# EAGLE design Inteligentny czujnik pojemnościowy (EAGLE 8.0.1)

## Sheet 1 of 2
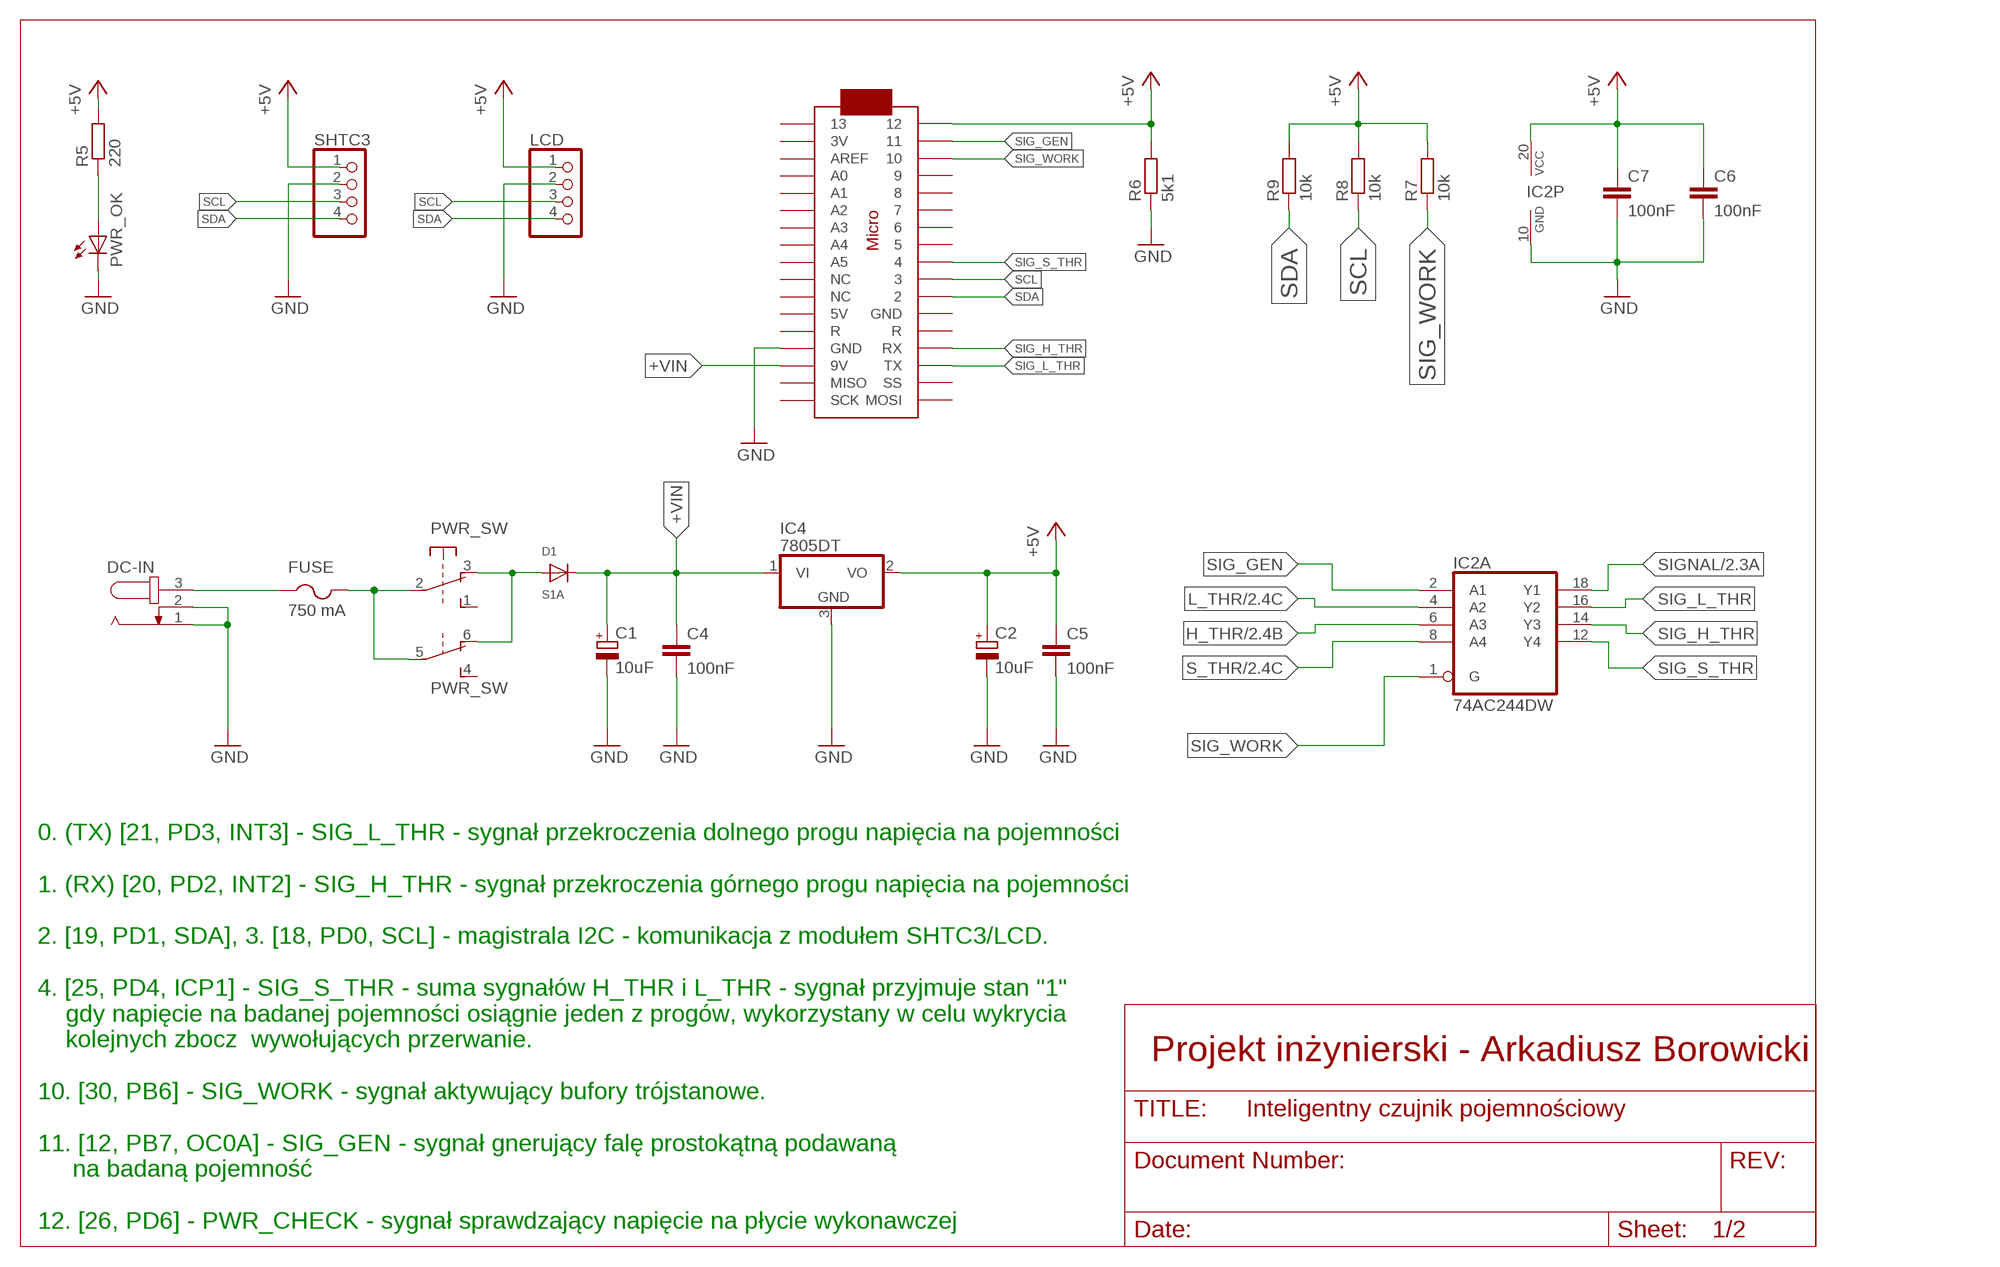
[diagram p0: schematic, sheet 1]

### Parts
C1  10uF  CPOL-EU153CLV-0605  [153CLV-0605]
C2  10uF  CPOL-EU153CLV-0605  [153CLV-0605]
C4  100nF  C-EUC1206K  [C1206K]
C5  100nF  C-EUC1206K  [C1206K]
C6  100nF  C-EUC1206K  [C1206K]
C7  100nF  C-EUC1206K  [C1206K]
D1  S1A  DIODESMA  [SMADIODE]
DC-IN  JACK-PLUG1  [SPC4078]
FUSE  750 mA  PTCFUSE-1812  [1812]
IC2  74AC244DW  [SO20W]
IC4  7805DT  [TO252]
LCD  PINHD-1X4  [1X04]
PWR_OK  LEDSMT1206  [1206]
PWR_SW  9077-2  [9077-2]
R5  220  R-EU_R1206  [R1206]
R6  5k1  R-EU_R1206  [R1206]
R7  10k  R-EU_R1206  [R1206]
R8  10k  R-EU_R1206  [R1206]
R9  10k  R-EU_R1206  [R1206]
SHTC3  PINHD-1X4  [1X04]
U$1  ARDUINOMICRO  [ARDUINOMICRO]

### Nets
+5V: C2.+ C5.1 C6.1 C7.1 IC2.20(P:VCC) IC4.2(VO) LCD.1 R5.2 R6.2 R7.2 R8.2 R9.2 SHTC3.1 U$1.P$1 ; also sheet 2
+VIN: C1.+ C4.1 D1.C IC4.1(VI) U$1.P$20(9V)
GND: C1.- C2.- C4.2 C5.2 C6.2 C7.2 DC-IN.1 DC-IN.2 IC2.10(P:GND) IC4.3(GND) LCD.2 PWR_OK.C R6.1 SHTC3.2 U$1.P$12(GND) ; also sheet 2
H_THR: IC2.6(A:A3) ; also sheet 2
L_THR: IC2.4(A:A2) ; also sheet 2
N$4: DC-IN.3 FUSE.1
N$5: PWR_OK.A R5.1
N$6: D1.A PWR_SW.3(1:O) PWR_SW.6(2:O)
N$8: FUSE.2 PWR_SW.2(1:P) PWR_SW.5(2:P)
S_THR: IC2.8(A:A4) ; also sheet 2
SCL: LCD.3 R8.1 SHTC3.3 U$1.P$10
SDA: LCD.4 R9.1 SHTC3.4 U$1.P$11
SIG_GEN: IC2.2(A:A1) U$1.P$2
SIG_H_THR: IC2.14(A:Y3) U$1.P$14(RX)
SIG_L_THR: IC2.16(A:Y2) U$1.P$15(TX)
SIG_S_THR: IC2.12(A:Y4) U$1.P$9
SIG_WORK: IC2.1(A:G) R7.1 U$1.P$3
SIGNAL: IC2.18(A:Y1) ; also sheet 2
Unconnected: IC2.3(B:Y4) IC2.5(B:Y3) IC2.7(B:Y2) IC2.9(B:Y1) IC2.11(B:A1) IC2.13(B:A2) IC2.15(B:A3) IC2.17(B:A4) IC2.19(B:G) PWR_SW.1(1:S) PWR_SW.4(2:S) U$1.P$4 U$1.P$5 U$1.P$6 U$1.P$7 U$1.P$8 U$1.P$13(R) U$1.P$16(SS) U$1.P$17(MOSI) U$1.P$18(SCK) U$1.P$19(MISO) U$1.P$21(GND) U$1.P$22(R) U$1.P$23(5V) U$1.P$24(NC) U$1.P$25(NC) U$1.P$26(A5) U$1.P$27(A4) U$1.P$28(A3) U$1.P$29(A2) U$1.P$30(A1) U$1.P$31(A0) U$1.P$32(AREF) U$1.P$33(3V) U$1.P$34

### Notes on the sheet
- Projekt inżynierski - Arkadiusz Borowicki
- 0. (TX) [21, PD3, INT3] - SIG_L_THR - sygnał przekroczenia dolnego progu napięcia na pojemności 
      
  1. (RX) [20, PD2, INT2] - SIG_H_THR - sygnał przekroczenia górnego progu napięcia na pojemności
  
  2. [19, PD1, SDA], 3. [18, PD0, SCL] - magistrala I2C - komunikacja z modułem SHTC3/LCD.
  
  4. [25, PD4, ICP1] - SIG_S_THR - suma sygnałów H_THR i L_THR - sygnał przyjmuje stan "1"
      gdy napięcie na badanej pojemności osiągnie jeden z progów, wykorzystany w celu wykrycia
      kolejnych zbocz  wywołujących przerwanie.
  
  10. [30, PB6] - SIG_WORK - sygnał aktywujący bufory trójstanowe. 
  
  11. [12, PB7, OC0A] - SIG_GEN - sygnał gnerujący falę prostokątną podawaną 
       na badaną pojemność
  
  12. [26, PD6] - PWR_CHECK - sygnał sprawdzający napięcie na płycie wykonawczej

## Sheet 2 of 2
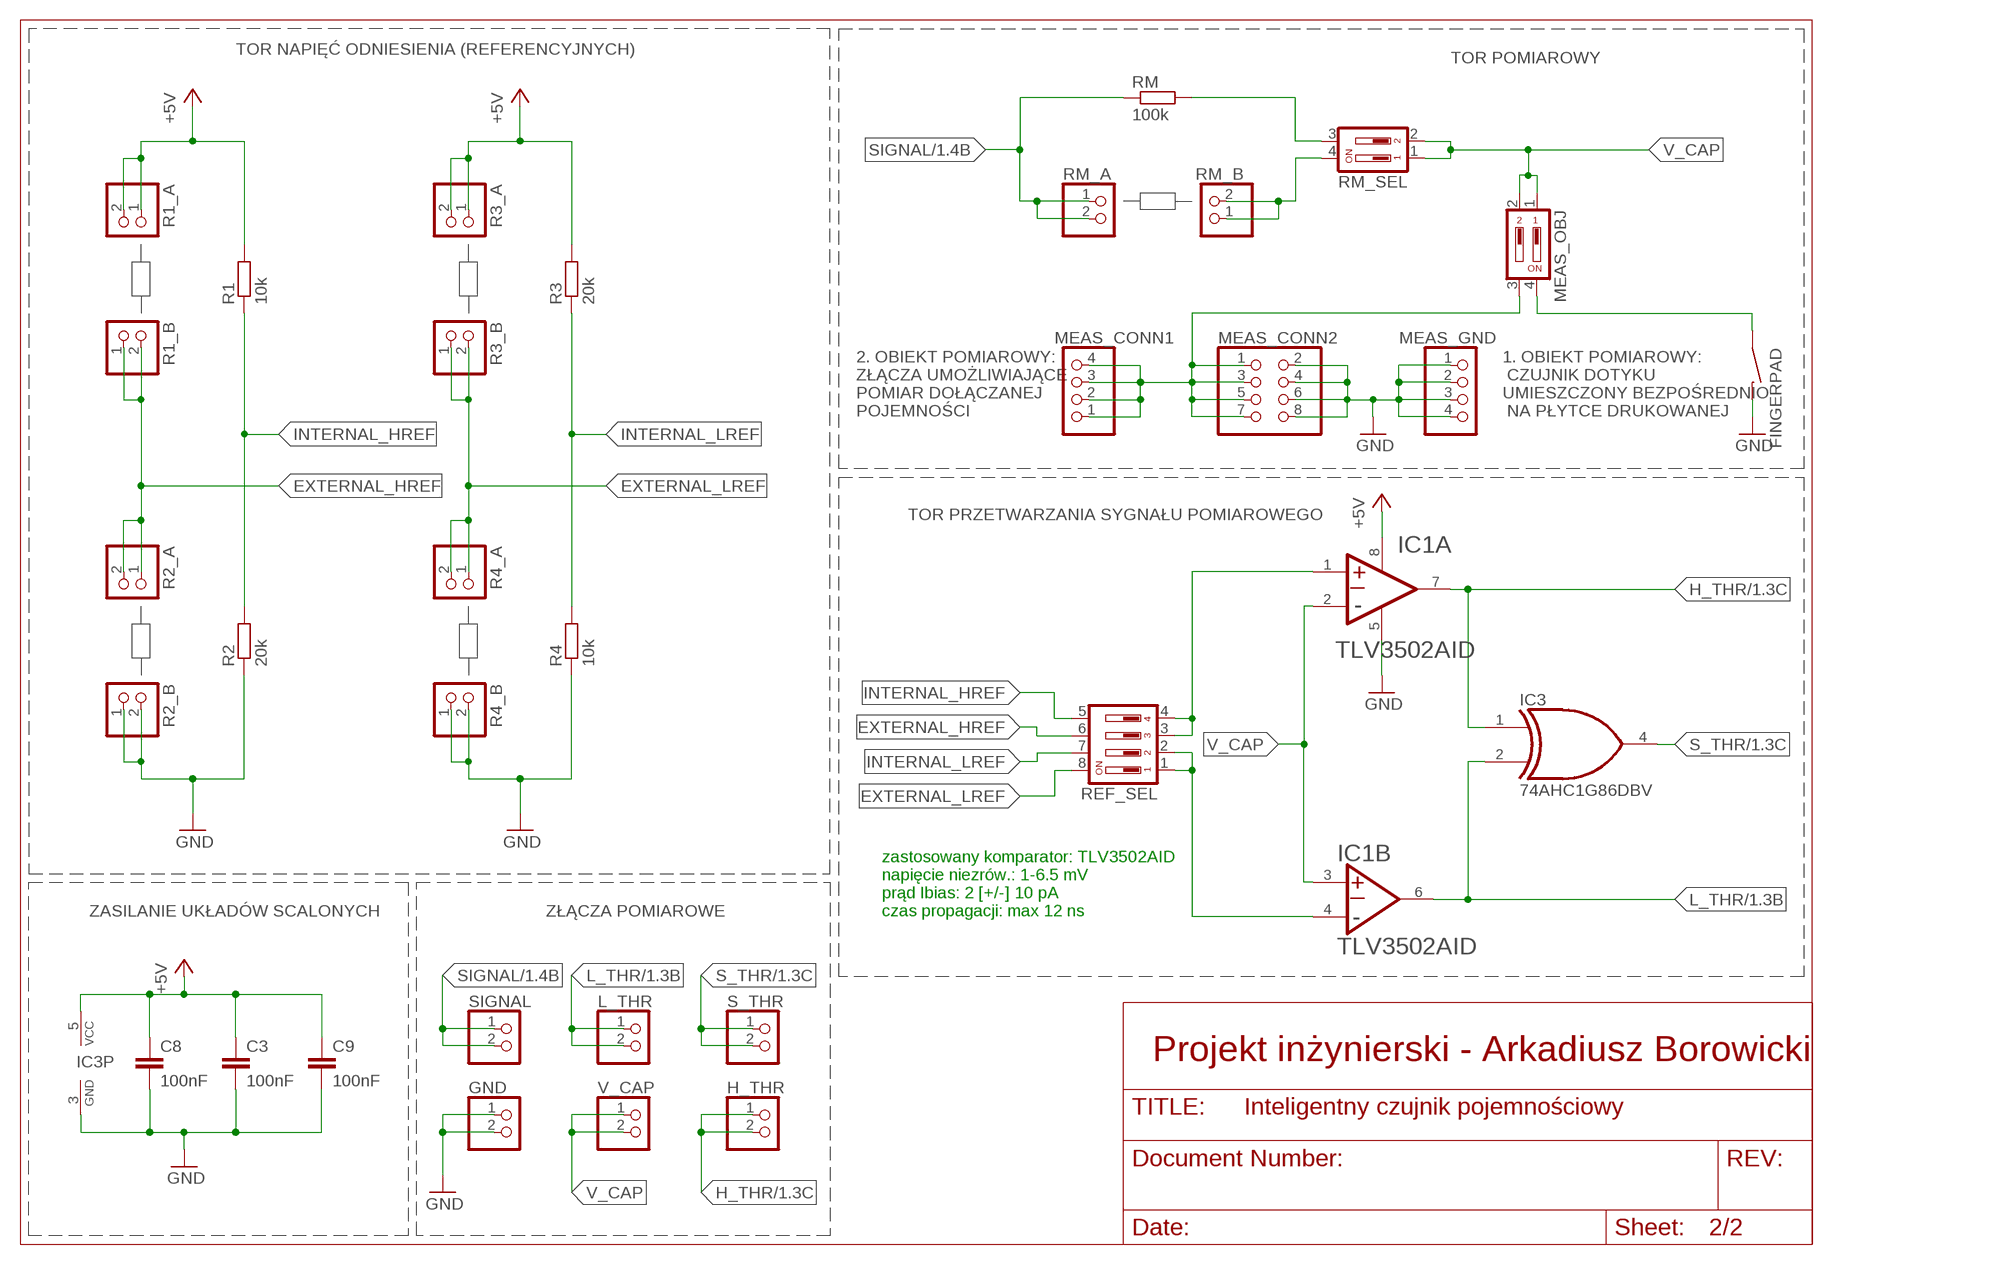
[diagram p1: schematic, sheet 2]

### Parts
C3  100nF  C-EUC1206K  [C1206K]
C8  100nF  C-EUC1206K  [C1206K]
C9  100nF  C-EUC1206K  [C1206K]
FINGERPAD  FINGERPAD-2B  [FINGERPAD-2B]
GND  PINHD-1X2  [1X02]
H_THR  PINHD-1X2  [1X02]
IC1  TEXAS_INSTRUMENTS_TLV3502AIDTEXAS_INSTRUMENTS_TLV3502AID_0_1  [TEXAS_INSTRUMENTS_TLV3502AID_1]
IC3  74AHC1G86DBV  [SOT23-5]
L_THR  PINHD-1X2  [1X02]
MEAS_CONN1  PINHD-1X4  [1X04]
MEAS_CONN2  PINHD-2X4  [2X04]
MEAS_GND  PINHD-1X4  [1X04]
MEAS_OBJ  219-02  [CTS-219-02]
R1  10k  R-EU_M1206  [M1206]
R1_A  PINHD-1X2  [1X02]
R1_B  PINHD-1X2  [1X02]
R2  20k  R-EU_M1206  [M1206]
R2_A  PINHD-1X2  [1X02]
R2_B  PINHD-1X2  [1X02]
R3  20k  R-EU_M1206  [M1206]
R3_A  PINHD-1X2  [1X02]
R3_B  PINHD-1X2  [1X02]
R4  10k  R-EU_M1206  [M1206]
R4_A  PINHD-1X2  [1X02]
R4_B  PINHD-1X2  [1X02]
REF_SEL  219-04  [CTS-219-04]
RM  100k  R-EU_M1206  [M1206]
RM_A  PINHD-1X2  [1X02]
RM_B  PINHD-1X2  [1X02]
RM_SEL  219-02  [CTS-219-02]
S_THR  PINHD-1X2  [1X02]
SIGNAL  PINHD-1X2  [1X02]
V_CAP  PINHD-1X2  [1X02]

### Nets
+5V: C3.1 C8.1 C9.1 IC1.8(A:V+) IC3.5(VCC) R1.2 R1_A.1 R1_A.2 R3.2 R3_A.1 R3_A.2 ; also sheet 1
EXT_RM: RM_B.1 RM_B.2 RM_SEL.4
EXTERNAL_HREF: R1_B.1 R1_B.2 R2_A.1 R2_A.2 REF_SEL.6
EXTERNAL_LREF: R3_B.1 R3_B.2 R4_A.1 R4_A.2 REF_SEL.8
GND: C3.2 C8.2 C9.2 FINGERPAD.2 GND.1 GND.2 IC1.5(A:V−) IC3.3(GND) MEAS_CONN2.2 MEAS_CONN2.4 MEAS_CONN2.6 MEAS_CONN2.8 MEAS_GND.1 MEAS_GND.2 MEAS_GND.3 MEAS_GND.4 R2.1 R2_B.1 R2_B.2 R4.1 R4_B.1 R4_B.2 ; also sheet 1
H_REF: IC1.1(A:+IN_A) REF_SEL.3 REF_SEL.4
H_THR: H_THR.1 H_THR.2 IC1.7(A:OUT_A) IC3.1(I0) ; also sheet 1
INT_RM: RM.2 RM_SEL.3
INTERNAL_HREF: R1.1 R2.2 REF_SEL.5
INTERNAL_LREF: R3.1 R4.2 REF_SEL.7
L_REF: IC1.4(B:−IN_B) REF_SEL.1 REF_SEL.2
L_THR: IC1.6(B:OUT_B) IC3.2(I1) L_THR.1 L_THR.2 ; also sheet 1
N$1: FINGERPAD.1 MEAS_OBJ.4
N$2: MEAS_CONN1.1 MEAS_CONN1.2 MEAS_CONN1.3 MEAS_CONN1.4 MEAS_CONN2.1 MEAS_CONN2.3 MEAS_CONN2.5 MEAS_CONN2.7 MEAS_OBJ.3
S_THR: IC3.4(O) S_THR.1 S_THR.2 ; also sheet 1
SIGNAL: RM.1 RM_A.1 RM_A.2 SIGNAL.1 SIGNAL.2 ; also sheet 1
V_CAP: IC1.2(A:−IN_A) IC1.3(B:+IN_B) MEAS_OBJ.1 MEAS_OBJ.2 RM_SEL.1 RM_SEL.2 V_CAP.1 V_CAP.2

### Notes on the sheet
- TOR NAPIĘĆ ODNIESIENIA (REFERENCYJNYCH)
- TOR POMIAROWY
- 2. OBIEKT POMIAROWY:
  ZŁĄCZA UMOŻLIWIAJĄCE
  POMIAR DOŁĄCZANEJ
  POJEMNOŚCI
- 1. OBIEKT POMIAROWY:
   CZUJNIK DOTYKU
  UMIESZCZONY BEZPOŚREDNIO
   NA PŁYTCE DRUKOWANEJ
- TOR PRZETWARZANIA SYGNAŁU POMIAROWEGO
- ZASILANIE UKŁADÓW SCALONYCH | ZŁĄCZA POMIAROWE
- zastosowany komparator: TLV3502AID
  napięcie niezrów.: 1-6.5 mV
  prąd Ibias: 2 [+/-] 10 pA
  czas propagacji: max 12 ns
- Projekt inżynierski - Arkadiusz Borowicki

## Library data of the parts
C1 C2 = resistor:CPOL-EU: POLARIZED CAPACITOR, European symbol
C3-C9 = resistor:C-EU: CAPACITOR, European symbol
D1 = adafruit:DIODE: Diode SMADIODE - SMA Surface Mount Package 20V 1A Schottky Diode Digikey: 641-1014-6-ND DO-1N4148 - Through Hole Small Current Diode SOD-123 20V 1 A (.5mV Vf) Schottky Diode - Digikey: MBRX120TPMSCT-ND SOD-323 10V 570mA (.38mV Vf, 3ns) Schottky Diode - Digikey: ZLLS410CT-ND SOD-523 30V 30mA Schottky Diode (RB751S-40TE61) - Digikey: RB751S-40TE61CT-ND SOT23-R/W - SOT23 Package (R = Solder Paste/Reflow Ovens, W = Hand-Soldering) BAT54Film 40V 300mA - Digikey: 497-7162-1-ND
DC-IN = con-jack:JACK-PLUG: DC POWER JACK Power Jack, DC, Right Angle, Through Hole, Rated 5A at 16VDC, PC Terminals Distributor: Farnell (www.Farnell.de) Drawing: 84N1161.pdf / 84N1162.pdf Manufacturer: SPC Technology (www.spctechnology.com) Type: SPC4077 / SPC 4078; OC_FARNELL: unknown; OC_NEWARK: unknown
FINGERPAD = dom-key:FINGERPAD-2B: Source: http://www.polycase.com/uploads/14531129045666549.pdf
FUSE = adafruit:PTCFUSE: PTC fuses, resettable thermistors
GND H_THR L_THR R1_A R1_B R2_A R2_B R3_A R3_B R4_A R4_B RM_A RM_B S_THR SIGNAL V_CAP = pinhead:PINHD-1X2: PIN HEADER
IC1 = Texas Instruments - TLV3502AID:TEXAS_INSTRUMENTS_TLV3502AID: Comparator General Purpose CMOS, Push-Pull, Rail-to-Rail, TTL 8-SOIC; AMBIENT_TEMPERATURE_RANGE_HIGH: +125°C; AMBIENT_TEMPERATURE_RANGE_LOW: -40°C; AUTOMOTIVE: No; CENTROID_NOT_SPECIFIED: No; DATASHEET: http://www.ti.com/lit/ds/symlink/tlv3502.pdf; DEVICE_CLASS_L1: Integrated Circuits (ICs); DEVICE_CLASS_L2: Linear ICs; DEVICE_CLASS_L3: Comparators; DIGIKEY_DESCRIPTION: IC COMPARATOR R-R HI-SPD 8-SOIC; DIGIKEY_PART_NUMBER: 296-18301-5-ND; FOOTPRINT_PARAMETERS_1: {"fp_type":"SOIC_narrow","params":{"N":{"nom":"8","long name":"Number of leads","min":null,"max":null,"short name":"N","type":"count"},"A":{"nom":false,"long name":"Height","min":false,"max":1750000,"short name":"A","type":"measurement"},"A1":{"nom":false,"long name":"Package clearance","min":110000,"max":250000,"short name":"A1","type":"measurement"},"A2":{"nom":false,"long name":"Package height","min":false,"max":1500000,"short name":"A2","type":"measurement"},"D":{"nom":false,"long name":"Package length","min":4810000,"max":5000000,"short name":"D","type":"measurement"},"E":{"nom":false,"long name":"Width w/ leads","min":5800000,"max":6190000,"short name":"E","type":"measurement"},"E1":{"nom":false,"long name":"Package width","min":3810000,"max":3980000,"short name":"E1","type":"measurement"},"B":{"nom":false,"long name":"Lead width","min":310000,"max":510000,"short name":"B","type":"measurement"},"C":{"nom":false,"long name":"Lead thickness","min":130000,"max":250000,"short name":"C","type":"measurement"},"e":{"nom":1270000,"long name":"Lead pitch","min":null,"max":null,"short name":"e","type":"measurement"},"L":{"nom":false,"long name":"Lead foot length","min":410000,"max":1270000,"short name":"L","type":"measurement"},"PHI":{"nom":false,"long name":"Lead foot angle","min":0,"max":8000000,"short name":"PHI","type":"measurement"},"HT":{"default":"No","long name":"Thermal pad","type":"multichoiceparent","short name":"HT","children":[]},"offset x":{"nom":0,"long name":"X Center offset","min":null,"max":null,"short name":"offset x","type":"measurement"},"offset y":{"nom":0,"long name":"Y Center offset","min":null,"max":null,"short name":"offset y","type":"measurement"},"LS":{"default":"Rounded rectangle","long name":"Land shape","type":"multichoice","short name":"LS"},"LS1":{"default":"Rectangle","long name":"Land shape (Pin 1)","type":"multichoice","short name":"LS1"},"solder toe":{"nom":550000,"long name":"Solder fillet (toe)","min":null,"max":null,"short name":"solder toe","type":"fixedmeasurement"},"solder heel":{"nom":450000,"long name":"Solder fillet (heel)","min":null,"max":null,"short name":"solder heel","type":"fixedmeasurement"},"solder side":{"nom":50000,"long name":"Solder fillet (side)","min":null,"max":null,"short name":"solder side","type":"fixedmeasurement"},"courtyard":{"nom":500000,"long name":"Courtyard","min":null,"max":null,"short name":"courtyard","type":"fixedmeasurement"},"SF":{"default":"A","long name":"Packing level","type":"multichoiceparent","short name":"SF","help":"http://support.upverter.com/customer/portal/articles/978783-what-is-a-footprint-packing-level","children":["solder toe","solder heel","solder side","courtyard"]}}}; FOOTPRINT_PARAMETERS_2: {"fp_type":"SOIC_narrow","params":{"N":{"nom":"8","long name":"Number of leads","min":null,"max":null,"short name":"N","type":"count"},"A":{"nom":false,"long name":"Height","min":false,"max":1750000,"short name":"A","type":"measurement"},"A1":{"nom":false,"long name":"Package clearance","min":110000,"max":250000,"short name":"A1","type":"measurement"},"A2":{"nom":false,"long name":"Package height","min":false,"max":1500000,"short name":"A2","type":"measurement"},"D":{"nom":false,"long name":"Package length","min":4810000,"max":5000000,"short name":"D","type":"measurement"},"E":{"nom":false,"long name":"Width w/ leads","min":5800000,"max":6190000,"short name":"E","type":"measurement"},"E1":{"nom":false,"long name":"Package width","min":3810000,"max":3980000,"short name":"E1","type":"measurement"},"B":{"nom":false,"long name":"Lead width","min":310000,"max":510000,"short name":"B","type":"measurement"},"C":{"nom":false,"long name":"Lead thickness","min":130000,"max":250000,"short name":"C","type":"measurement"},"e":{"nom":1270000,"long name":"Lead pitch","min":null,"max":null,"short name":"e","type":"measurement"},"L":{"nom":false,"long name":"Lead foot length","min":410000,"max":1270000,"short name":"L","type":"measurement"},"PHI":{"nom":false,"long name":"Lead foot angle","min":0,"max":8000000,"short name":"PHI","type":"measurement"},"HT":{"default":"No","long name":"Thermal pad","type":"multichoiceparent","short name":"HT","children":[]},"offset x":{"nom":0,"long name":"X Center offset","min":null,"max":null,"short name":"offset x","type":"measurement"},"offset y":{"nom":0,"long name":"Y Center offset","min":null,"max":null,"short name":"offset y","type":"measurement"},"LS":{"default":"Rounded rectangle","long name":"Land shape","type":"multichoice","short name":"LS"},"LS1":{"default":"Rectangle","long name":"Land shape (Pin 1)","type":"multichoice","short name":"LS1"},"solder toe":{"nom":350000,"long name":"Solder fillet (toe)","min":null,"max":null,"short name":"solder toe","type":"fixedmeasurement"},"solder heel":{"nom":350000,"long name":"Solder fillet (heel)","min":null,"max":null,"short name":"solder heel","type":"fixedmeasurement"},"solder side":{"nom":30000,"long name":"Solder fillet (side)","min":null,"max":null,"short name":"solder side","type":"fixedmeasurement"},"courtyard":{"nom":250000,"long name":"Courtyard","min":null,"max":null,"short name":"courtyard","type":"fixedmeasurement"},"SF":{"default":"B","long name":"Packing level","type":"multichoiceparent","short name":"SF","help":"http://support.upverter.com/customer/portal/articles/978783-what-is-a-footprint-packing-level","children":["solder toe","solder heel","solder side","courtyard"]}}}; FOOTPRINT_PARAMETERS_3: {"fp_type":"SOIC_narrow","params":{"N":{"nom":"8","long name":"Number of leads","min":null,"max":null,"short name":"N","type":"count"},"A":{"nom":false,"long name":"Height","min":false,"max":1750000,"short name":"A","type":"measurement"},"A1":{"nom":false,"long name":"Package clearance","min":110000,"max":250000,"short name":"A1","type":"measurement"},"A2":{"nom":false,"long name":"Package height","min":false,"max":1500000,"short name":"A2","type":"measurement"},"D":{"nom":false,"long name":"Package length","min":4810000,"max":5000000,"short name":"D","type":"measurement"},"E":{"nom":false,"long name":"Width w/ leads","min":5800000,"max":6190000,"short name":"E","type":"measurement"},"E1":{"nom":false,"long name":"Package width","min":3810000,"max":3980000,"short name":"E1","type":"measurement"},"B":{"nom":false,"long name":"Lead width","min":310000,"max":510000,"short name":"B","type":"measurement"},"C":{"nom":false,"long name":"Lead thickness","min":130000,"max":250000,"short name":"C","type":"measurement"},"e":{"nom":1270000,"long name":"Lead pitch","min":null,"max":null,"short name":"e","type":"measurement"},"L":{"nom":false,"long name":"Lead foot length","min":410000,"max":1270000,"short name":"L","type":"measurement"},"PHI":{"nom":false,"long name":"Lead foot angle","min":0,"max":8000000,"short name":"PHI","type":"measurement"},"HT":{"default":"No","long name":"Thermal pad","type":"multichoiceparent","short name":"HT","children":[]},"offset x":{"nom":0,"long name":"X Center offset","min":null,"max":null,"short name":"offset x","type":"measurement"},"offset y":{"nom":0,"long name":"Y Center offset","min":null,"max":null,"short name":"offset y","type":"measurement"},"LS":{"default":"Rounded rectangle","long name":"Land shape","type":"multichoice","short name":"LS"},"LS1":{"default":"Rectangle","long name":"Land shape (Pin 1)","type":"multichoice","short name":"LS1"},"solder toe":{"nom":150000,"long name":"Solder fillet (toe)","min":null,"max":null,"short name":"solder toe","type":"fixedmeasurement"},"solder heel":{"nom":250000,"long name":"Solder fillet (heel)","min":null,"max":null,"short name":"solder heel","type":"fixedmeasurement"},"solder side":{"nom":10000,"long name":"Solder fillet (side)","min":null,"max":null,"short name":"solder side","type":"fixedmeasurement"},"courtyard":{"nom":100000,"long name":"Courtyard","min":null,"max":null,"short name":"courtyard","type":"fixedmeasurement"},"SF":{"default":"C","long name":"Packing level","type":"multichoiceparent","short name":"SF","help":"http://support.upverter.com/customer/portal/articles/978783-what-is-a-footprint-packing-level","children":["solder toe","solder heel","solder side","courtyard"]}}}; FOOTPRINT_VARIANT_NAME_0: Recommended_Land_Pattern; FOOTPRINT_VARIANT_NAME_1: IPC_A; FOOTPRINT_VARIANT_NAME_2: IPC_B; FOOTPRINT_VARIANT_NAME_3: IPC_C; HEIGHT: 1.75mm; INPUT_BIAS_CURRENT: 0.000002uA; INPUT_OFFSET_VOLTAGE: 1mV; LEAD_FREE: Yes; MAX_JUNCTION_TEMP: +150°C; MAX_SUPPLY_VOLTAGE: 5.5V; MF: Texas Instruments; MFG_PACKAGE_IDENT: D0008A; MFG_PACKAGE_IDENT_COMPONENT_ID: 13156bb2a70d55c4; MFG_PACKAGE_IDENT_DATE: 0; MFG_PACKAGE_IDENT_REV: 0; MIN_SUPPLY_VOLTAGE: 2.2V; MOUSER_DESCRIPTION: TLV3502AID Texas Instruments, Dual Comparator, Push-Pull O/P, 3 V, 5 V 8-Pin SOIC; MOUSER_PART_NUMBER: 595-TLV3502AID; MPN: TLV3502AID; NOMINAL_SUPPLY_CURRENT: 3.2mA; NUMBER_OF_CHANNELS: 2; PACKAGE: SOIC8; PREFIX: U; ROHS: Yes; STANDOFF_HEIGHT: 0.11mm; TEMPERATURE_RANGE_HIGH: +125°C; TEMPERATURE_RANGE_LOW: -40°C; VERIFICATION_VERSION: 0.0.0.3
IC2 = 74xx-eu:74*244: Octal BUFFER and LINE DRIVER, 3-state
IC3 = 74xx-little-us:74*1G86: 2-input EXCLUSIV-OR gate
IC4 = adafruit:78*: Positive VOLTAGE REGULATOR Added bigger pads to the TO-92 package
LCD MEAS_CONN1 MEAS_GND SHTC3 = pinhead:PINHD-1X4: PIN HEADER
MEAS_CONN2 = pinhead:PINHD-2X4: PIN HEADER
MEAS_OBJ RM_SEL = switch-dil:219-02*: Surface Mount DIP Switch Series 219 SMT CTS Electronic Components Sourc: www.ctscorp.com; OC_FARNELL: unknown; OC_NEWARK: unknown
PWR_OK = adafruit:LED: LED OSRAM: - CHIPLED LG R971, LG N971, LY N971, LG Q971, LY Q971, LO R971, LY R971 LH N974, LH R974 LS Q976, LO Q976, LY Q976 LO Q996 - Hyper CHIPLED LW Q18S LB Q993, LB Q99A, LB R99A - SideLED LS A670, LO A670, LY A670, LG A670, LP A670 LB A673, LV A673, LT A673, LW A673 LH A674 LY A675 LS A676, LA A676, LO A676, LY A676, LW A676 LS A679, LY A679, LG A679 - Hyper Micro SIDELED® LS Y876, LA Y876, LO Y876, LY Y876 LT Y87S - SmartLED LW L88C, LW L88S LB L89C, LB L89S, LG L890 LS L89K, LO L89K, LY L89K LS L896, LA L896, LO L896, LY L896 - TOPLED LS T670, LO T670, LY T670, LG T670, LP T670 LSG T670, LSP T670, LSY T670, LOP T670, LYG T670 LG T671, LOG T671, LSG T671 LB T673, LV T673, LT T673, LW T673 LH T674 LS T676, LA T676, LO T676, LY T676, LB T676, LH T676, LSB T676, LW T676 LB T67C, LV T67C, LT T67C, LS T67K, LO T67K, LY T67K, LW E67C LS E67B, LA E67B, LO E67B, LY E67B, LB E67C, LV E67C, LT E67C LW T67C LS T679, LY T679, LG T679 LS T770, LO T770, LY T770, LG T770, LP T770 LB T773, LV T773, LT T773, LW T773 LH T774 LS E675, LA E675, LY E675, LS T675 LS T776, LA T776, LO T776, LY T776, LB T776 LHGB T686 LT T68C, LB T68C - Hyper Mini TOPLED® LB M676 - Mini TOPLED Santana® LG M470 LS M47K, LO M47K, LY M47K Source: http://www.osram.convergy.de/
PWR_SW = switch-misc:9077-2: MARQUARDT SWITCH 9077.0200 Distributor: Buerklin <https://www.buerklin.com/default.asp?event=ShowArtikel%2812G2822%29&l=d&jump=ArtNr_12G2822>
R1-R9 RM = resistor:R-EU_: RESISTOR, European symbol
REF_SEL = switch-dil:219-04*: Surface Mount DIP Switch Series 219 SMT CTS Electronic Components Sourc: www.ctscorp.com; OC_FARNELL: unknown; OC_NEWARK: unknown
U$1 = adafruit:ARDUINOMICRO

## Board
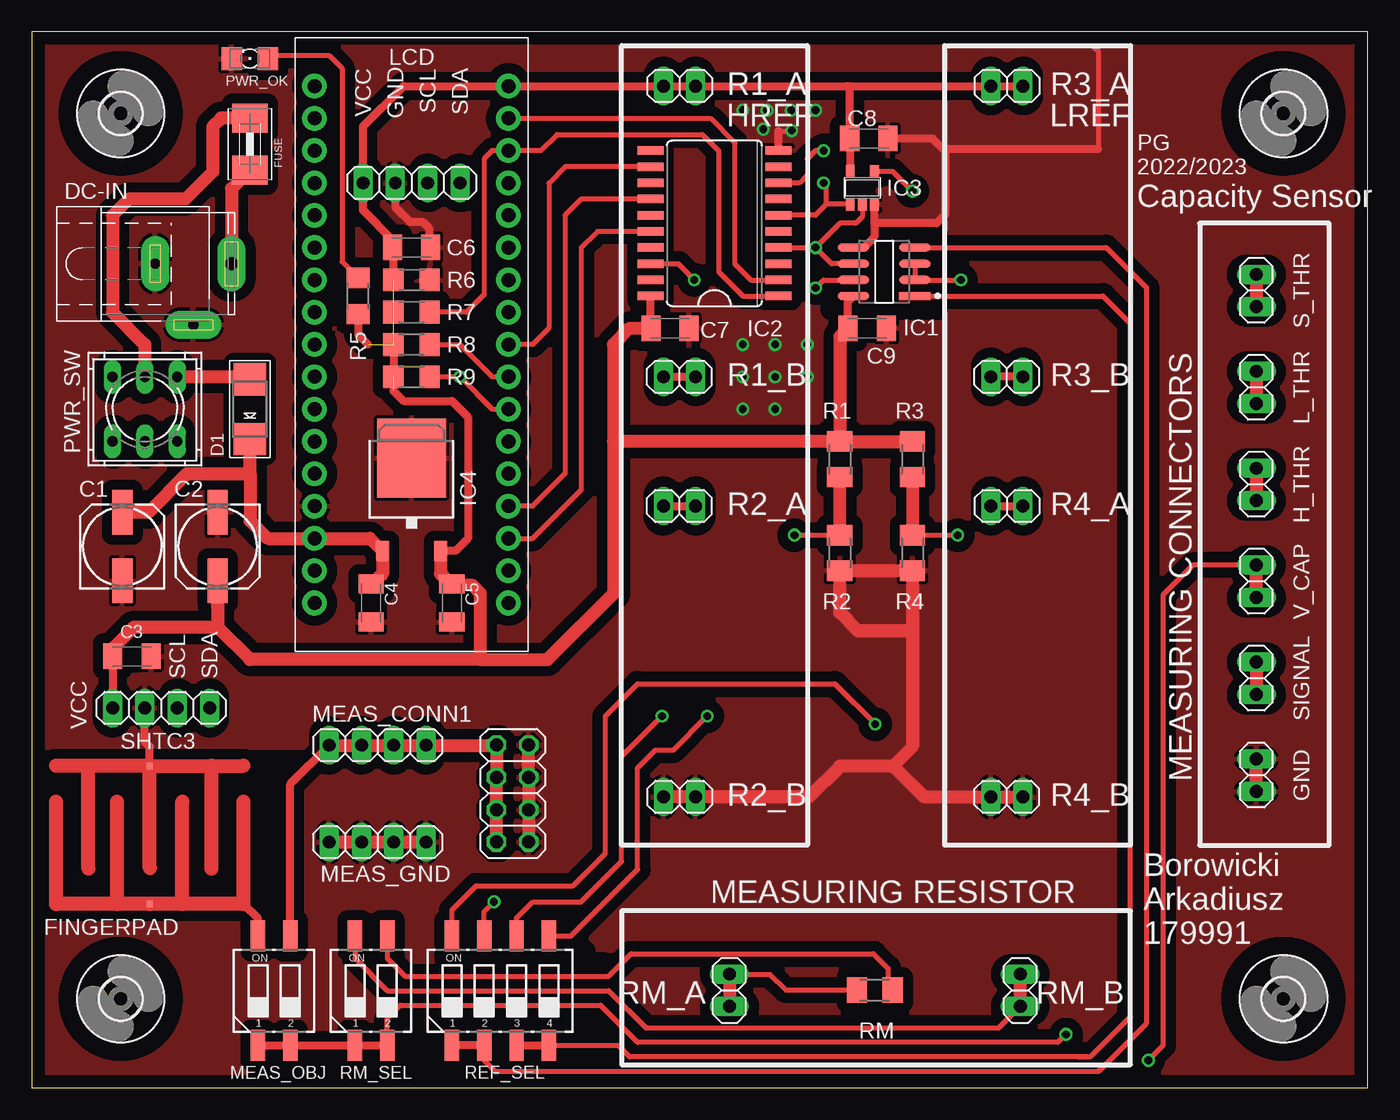
[diagram p2: board, top side]
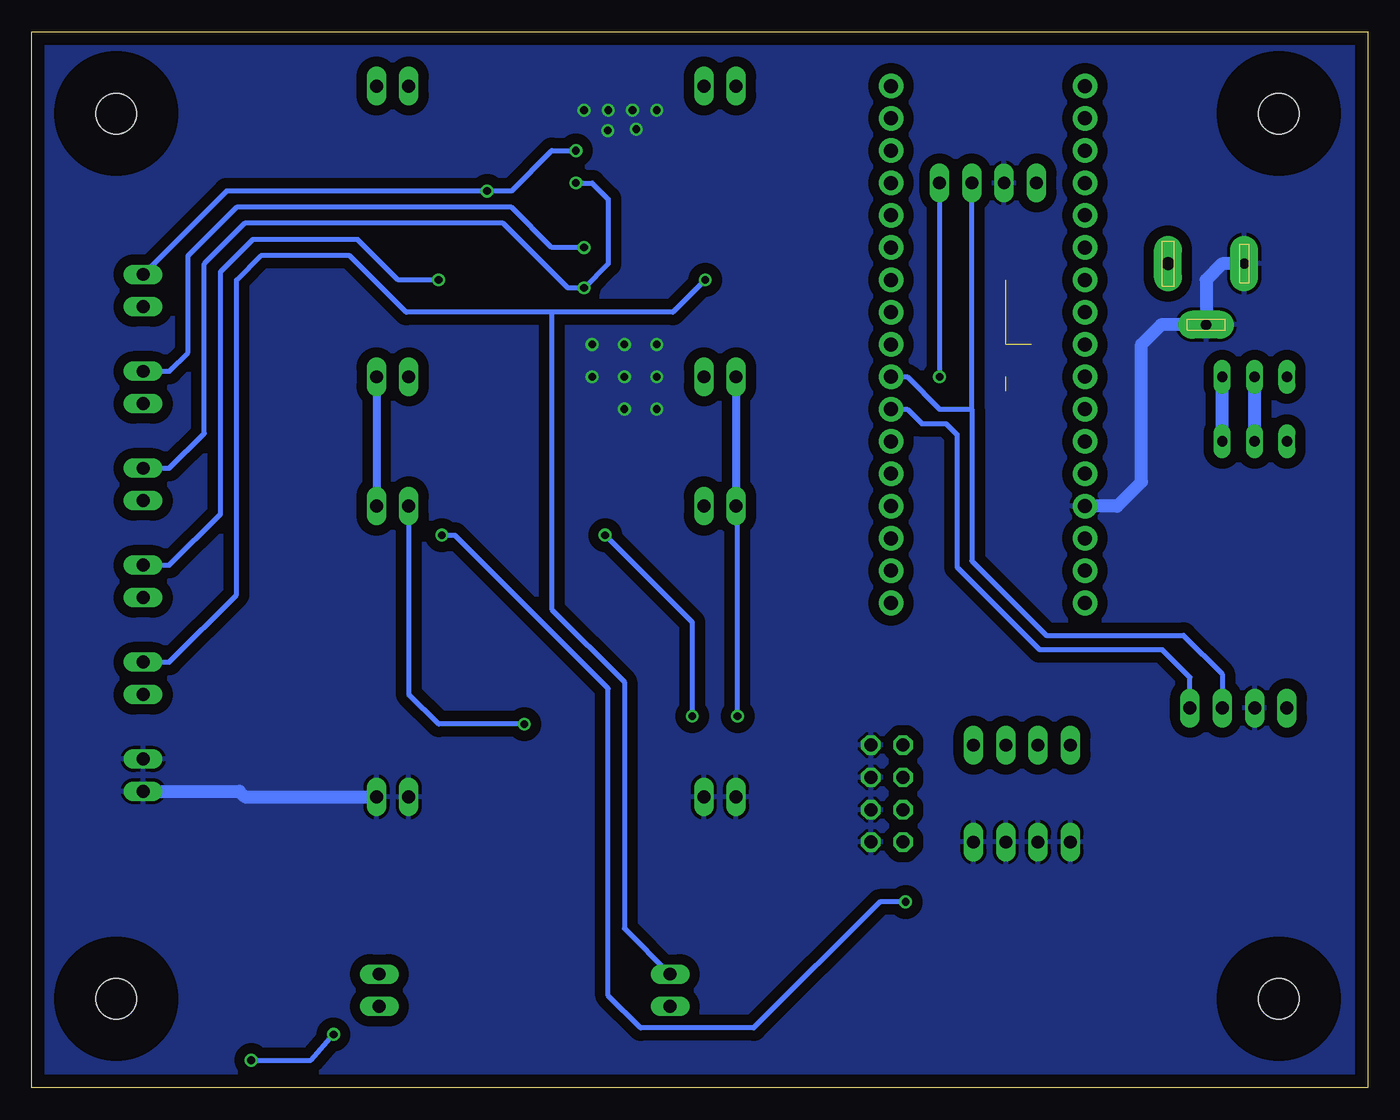
[diagram p3: board, bottom side, seen from below]

Size 105 x 83 mm. Coordinates in mm from the lower left corner, seen from the top.
Outline: 0,0 105,0 105,83 0,83 0,0
Copper layers (1*16): Top 0.035mm / dielectric 1.5mm / Bottom 0.035mm
Design rules "default *": minimum track width 10mil, minimum drill 20mil, track to track 8mil, track to pad 8mil, pad to pad 8mil, via to via 8mil, smd to smd 8mil, copper to edge 40mil, drill to drill 8mil, minimum pad ring 10mil, minimum via ring 8mil, stop-mask expansion 4mil, vias tented up to drill 25mil, thermal gap 10mil
tRestrict: area 32.6,37.6 to 33.9,38.5; area 29.1,65.8 to 30.2,66.3; 91 lines

### Footprints (pad centres in the part's own frame; a part is rotated, then mirrored left to right if it is on the bottom)
153CLV-0605 = smd 3.5 x 1.6: + 2.7,0; - -2.7,0
C1206K = smd 1.5 x 2: 1 -1.5,0; 2 1.5,0
SMADIODE = smd 2.54 x 2.54: A 2.349,0; C -2.349,0
SPC4078 = drill 0.8 pad 2.184 long: 1 -3,0; 2 0,-4.8 | drill 1 pad 2.184 long: 3 3,0
FINGERPAD-2B = smd 0.5 x 0.5: 1 -5.365,0; 2 5.486,0
1812 = smd 2.286 x 2.794: 1 -2.046,0; 2 2.046,0
1X02 = drill 1.016 long: 1 -1.27,0; 2 1.27,0
TEXAS_INSTRUMENTS_TLV3502AID_1 = smd 2.469 x 0.622: 1 -2.414,1.905; 2 -2.414,0.635; 3 -2.414,-0.635; 4 -2.414,-1.905; 5 2.414,-1.905; 6 2.414,-0.635; 7 2.414,0.635; 8 2.414,1.905
SO20W = smd 0.66 x 2.032: 1 -5.715,-5.029; 2 -4.445,-5.029; 3 -3.175,-5.029; 4 -1.905,-5.029; 5 -0.635,-5.029; 6 0.635,-5.029; 7 1.905,-5.029; 8 3.175,-5.029; 9 4.445,-5.029; 10 5.715,-5.029; 11 5.715,5.029; 12 4.445,5.029; 13 3.175,5.029; 14 1.905,5.029; 15 0.635,5.029; 16 -0.635,5.029; 17 -1.905,5.029; 18 -3.175,5.029; 19 -4.445,5.029; 20 -5.715,5.029
SOT23-5 = smd 0.69 x 0.99: 1 -0.95,-1.29; 2 0,-1.29; 3 0.95,-1.29; 4 0.95,1.3; 5 -0.95,1.3
TO252 = smd 1 x 1.6: 1 -2.28,-4.8; 2 2.28,-4.8 | smd 5.4 x 6.2: 3 0,2.5
1X04 = drill 1.016 long: 1 -3.81,0; 2 -1.27,0; 3 1.27,0; 4 3.81,0
2X04 = drill 1.016 octagon: 1 -3.81,-1.27; 2 -3.81,1.27; 3 -1.27,-1.27; 4 -1.27,1.27; 5 1.27,-1.27; 6 1.27,1.27; 7 3.81,-1.27; 8 3.81,1.27
CTS-219-02 = smd 1.13 x 2.44: 1 -1.27,-4.3; 2 1.27,-4.3; 3 1.27,4.3; 4 -1.27,4.3
1206 = smd 1.6 x 1.803: A -1.422,0; C 1.422,0
9077-2 = drill 0.813 long: 1 -2.54,2.54; 2 0,2.54; 3 2.54,2.54; 4 -2.54,-2.54; 5 0,-2.54; 6 2.54,-2.54
M1206 = smd 1.6 x 2: 1 -1.4,0; 2 1.4,0
R1206 = smd 1.6 x 1.803: 1 -1.422,0; 2 1.422,0
CTS-219-04 = smd 1.13 x 2.44: 1 -3.81,-4.3; 2 -1.27,-4.3; 3 1.27,-4.3; 4 3.81,-4.3; 5 3.81,4.3; 6 1.27,4.3; 7 -1.27,4.3; 8 -3.81,4.3
ARDUINOMICRO = drill 1.1 pad 1.93: P$1 -20.32,7.62; P$2 -17.78,7.62; P$3 -15.24,7.62; P$4 -12.7,7.62; P$5 -10.16,7.62; P$6 -7.62,7.62; P$7 -5.08,7.62; P$8 -2.54,7.62; P$9 0,7.62; P$10 2.54,7.62; P$11 5.08,7.62; P$12 12.7,-7.62; P$13 10.16,-7.62; P$14 12.7,7.62; P$15 15.24,7.62; P$16 17.78,7.62; P$17 20.32,7.62; P$18 20.32,-7.62; P$19 17.78,-7.62; P$20 15.24,-7.62; P$21 7.62,7.62; P$22 10.16,7.62; P$23 7.62,-7.62; P$24 5.08,-7.62; P$25 2.54,-7.62; P$26 0,-7.62; P$27 -2.54,-7.62; P$28 -5.08,-7.62; P$29 -7.62,-7.62; P$30 -10.16,-7.62; P$31 -12.7,-7.62; P$32 -15.24,-7.62; P$33 -17.78,-7.62; P$34 -20.32,-7.62
3,2 = hole 3.2: 0,0

### Placement (x,y rotation side)
C1  7.11,42.55 90 top
C2  14.61,42.55 270 top
C3  7.87,33.91 0 top
C4  26.67,38.1 270 top
C5  33.02,38.1 270 top
C6  29.84,66.04 0 top
C7  50.16,59.69 0 top
C8  65.79,74.61 0 top
C9  65.66,59.69 0 top
D1  17.14,53.34 90 top
DC-IN  12.7,64.77 0 top
FINGERPAD  9.27,19.81 90 top
FUSE  17.14,74.17 90 top
GND  96.25,24.56 270 top
H_THR  96.25,47.42 270 top
IC1  66.99,64.14 180 top
IC2  53.66,67.94 90 top
IC3  65.28,70.74 0 top
IC4  29.84,46.99 0 top
L_THR  96.25,55.04 270 top
LCD  29.84,71.12 0 top
MEAS_CONN1  27.18,26.92 0 top
MEAS_CONN2  37.79,23.12 270 top
MEAS_GND  27.18,19.3 0 top
MEAS_OBJ  19.05,7.62 0 top
PWR_OK  17.14,80.9 180 top
PWR_SW  8.89,53.34 0 top
R1  63.5,49.4 90 top
R1_A  50.91,78.74 0 top
R1_B  50.91,55.88 180 top
R2  63.5,42.04 90 top
R2_A  50.91,45.72 180 top
R2_B  50.91,22.86 0 top
R3  69.22,49.4 90 top
R3_A  76.64,78.74 0 top
R3_B  76.64,55.88 180 top
R4  69.22,42.04 90 top
R4_A  76.64,45.72 0 top
R4_B  76.64,22.86 180 top
R5  25.65,62.23 270 top
R6  29.84,63.5 180 top
R7  29.84,60.96 180 top
R8  29.84,58.42 180 top
R9  29.84,55.88 180 top
REF_SEL  36.83,7.62 0 top
RM  66.26,7.66 0 top
RM_A  54.83,7.66 90 top
RM_B  77.69,7.66 90 top
RM_SEL  26.67,7.62 0 top
S_THR  96.25,62.66 270 top
SHTC3  10.16,29.84 0 top
SIGNAL  96.25,32.18 270 top
U$1  29.84,58.42 270 top
U$2  [3,2]  6.99,6.99 0 top
U$3  [3,2]  6.99,76.58 0 top
U$4  [3,2]  98.38,6.99 0 top
U$5  [3,2]  98.38,76.58 0 top
V_CAP  96.25,39.8 270 top

### Tracks (layer width: path | path; a pad name or v marks a point on that pad's centre or on a via)
+5V  (4 unrouted)
  Top 0.61: IC4.2 33.3,42.19 34.29,43.18 34.29,52.7 33.02,53.98 29.21,53.98 28.42,54.76 | IC3.5 64.33,74.57 C8.1 64.29,78.59 64.14,78.74 | 64.58,60.11 C9.1 64.16,61.81 IC1.8 | 64.14,78.74 R1_A.2 R1_A.1 U$1.P$1 29.21,78.74 26.04,75.56 LCD.1 26.04,68.96 28.45,66.55 C6.1 28.42,66.02 R6.2 | 64.14,78.74 R3_A.1 R3_A.2 | 14.48,37.97 14.61,37.85 | R5.2 25.65,59.18 26.42,58.42 | SHTC3.1 6.37,29.87 C3.1 6.35,33.93 6.35,34.54 | C7.1 48.63,59.73 IC2.20 | R8.2 R9.2
  Top 1.016: IC4.2 32.12,40.4 C5.1 34.63,39.5 35.24,38.89 35.24,33.66 | 64.11,59.65 C9.1 63.5,59.03 R1.2 | R1.2 63.35,50.67 | 69.08,50.67 R3.2 R1.2 | C7.1 46.99,59.69 45.72,58.42 45.72,50.8 | 45.72,50.8 R1.2 | 14.61,37.85 C2.+ 14.61,36.2 | 35.24,33.66 17.14,33.66 14.61,36.2 | 35.24,33.66 40.51,33.66 45.72,38.86 45.72,50.8 | 14.61,36.2 8,36.2 6.35,34.54
+VIN
  Top 1.016: C4.1 27.57,40.4 IC4.1 26.57,43.18 U$1.P$20 18.54,43.18 17.14,44.58 17.14,48.26 | 17.14,48.26 D1.C | C1.+ 9.18,45.24 12.19,48.26 17.14,48.26
EXT_RM
  Top 0.406: RM_SEL.4 25.4,10.16 27.94,7.62 45.34,7.62 48.26,4.7 75.99,4.7 RM_B.1
  Top 1.016: RM_B.1 RM_B.2
EXTERNAL_HREF  (via drill 0.6)
  Top 0.406: REF_SEL.6 38.1,13.34 39.37,14.61 43.18,14.61 46.35,17.78 46.35,26.04 v49.53,29.21
  Top 0.61: R1_B.2 R1_B.1 | R2_A.2 R2_A.1
  Bottom 0.406: v49.53,29.21 49.53,45.61 R2_A.2
  Bottom 0.61: R1_B.2 R2_A.2
EXTERNAL_LREF  (via drill 0.6)
  Top 0.406: REF_SEL.8 33.02,13.97 34.92,15.88 42.55,15.88 45.09,18.41 45.09,29.21 47.62,31.75 63.12,31.75 v66.29,28.57
  Top 0.61: R4_A.1 R4_A.2 | R3_B.1 R3_B.2
  Bottom 0.406: R4_A.1 75.37,30.92 73.03,28.57 v66.29,28.57
  Bottom 0.61: R3_B.1 R4_A.2
GND  (via drill 0.6)
  Top 0.406: 83.57,81.66 arc-90 83.82,81.41 83.82,73.79 | 58.69,75.2 59.73,75.2 v59.73,75.23
  Top 0.61: IC1.5 65.41,66.04 66.23,66.86 66.23,67.94 | 66.23,67.94 IC3.3 | C8.2 70.8,74.61 71.75,73.66 | 71.75,73.66 71.75,68.58 71.12,67.94 66.23,67.94 | IC2.10 58.69,75.2 | 83.82,73.79 71.88,73.79 71.75,73.66 | FINGERPAD.2 9.27,26.8 8.89,27.18 SHTC3.2 | LCD.2 28.57,69.22 29.72,68.07 30.73,68.07 31.24,67.56 31.24,66.04 C6.2
  Top 1.016: R2_B.1 R2_B.2 61.09,22.86 63.5,25.27 67.69,25.27 | GND.2 GND.1 | MEAS_CONN2.2 MEAS_CONN2.4 MEAS_CONN2.6 MEAS_CONN2.8 | MEAS_GND.1 MEAS_GND.2 MEAS_GND.3 MEAS_GND.4 | 7.14,39.24 C1.- | 67.69,25.27 70.1,22.86 R4_B.2 R4_B.1 | 69.22,35.94 69.22,26.8 67.69,25.27 | 69.22,35.94 64.9,35.94 63.5,37.34 R2.1 R4.1 69.22,35.94
  Bottom 1.016: DC-IN.1 11.43,64.77 12.7,63.5 DC-IN.2 16.23,59.97 17.78,58.42 17.78,47.62 19.68,45.72 U$1.P$12 | R4_B.1 88.27,22.86 88.7,23.29 GND.2
  other vias: 59.69,76.83 55.88,58.42 58.42,58.42 60.96,58.42 55.88,55.88 58.42,55.88 60.96,55.88 55.88,53.34 58.42,53.34 57.78,76.83 55.88,76.83 61.59,76.83 57.49,75.35
  pour Bottom (isolate 0.813): 0,83.19 105.41,83.19 105.41,-0.25 0,-0.13
  pour Top (isolate 0.813): 0,83.19 105.41,83.19 105.41,-0.25 0,-0.13
H_REF
  Top 0.406: REF_SEL.4 46.08,3.32 46.99,2.41 82.3,2.41 | IC1.1 84.2,62.23 86.36,60.07 86.36,5.59 83.19,2.41 82.3,2.41 | 83.06,2.41 82.3,2.41
  Top 0.61: REF_SEL.3 REF_SEL.4
H_THR  (via drill 0.6)
  Top 0.406: IC2.6 61.59,68.58 62.46,69.45 | IC3.1 62.46,69.45 | 62.46,69.45 62.46,70.89 v62.23,71.12 | v61.59,62.87 62.23,63.5 IC1.7
  Top 1.016: H_THR.1 H_THR.2
  Bottom 0.406: v62.23,71.12 60.96,71.12 59.69,69.85 59.69,64.77 v61.59,62.87 62.87,62.87 67.94,67.94 88.27,67.94 91.44,64.77 91.44,51.44 94.18,48.69 H_THR.1
INT_RM
  Top 0.406: RM.2 67.31,8.01 67.31,9.4 66.17,10.54 47.12,10.54 45.34,8.76 29.34,8.76 27.94,10.16 RM_SEL.3
INTERNAL_HREF  (via drill 0.6)
  Top 0.406: REF_SEL.5 42.4,11.92 47.62,17.14 47.62,25.15 49.02,26.54 50.42,26.54 v53.09,29.21 | v59.94,43.43 R2.2
  Top 1.016: R2.2 R1.1
  Bottom 0.406: v53.09,29.21 53.09,36.58 v59.94,43.43
INTERNAL_LREF  (via drill 0.6)
  Top 0.406: REF_SEL.7 35.56,13.84 v36.32,14.61 | R4.2 v72.77,43.44 v72.77,43.43
  Top 1.016: R3.1 R4.2
  Bottom 0.406: 65.79,37.47 | 65.79,37.47 59.69,31.37 59.69,7.24 57.15,4.7 48.26,4.7 38.35,14.61 v36.32,14.61 | v72.77,43.43 71.75,43.43 65.79,37.47
L_REF
  Top 0.406: IC1.4 84.45,66.04 87.63,62.87 87.63,5.08 83.82,1.27 36.45,1.27 35.56,2.16 REF_SEL.2
  Top 0.61: REF_SEL.2 REF_SEL.1
L_THR  (via drill 0.6)
  Top 0.406: IC1.6 62.87,64.77 v61.59,66.04 | IC2.4 v61.59,66.04 | IC3.2 65.28,68.45 64.77,67.94 63.5,67.94 v61.59,66.04
  Top 1.016: L_THR.1 L_THR.2
  Bottom 0.406: v61.59,66.04 64.14,66.04 67.31,69.22 88.9,69.22 92.71,65.41 92.71,57.78 94.18,56.31 L_THR.1
N$1
  Top 0.254: FINGERPAD.1 16.63,14.45
  Top 0.61: MEAS_OBJ.4 17.78,13.29 16.63,14.45
N$2
  Top 0.61: MEAS_CONN1.1 20.32,23.88 MEAS_OBJ.3
  Top 1.016: MEAS_CONN1.1 MEAS_CONN1.2 MEAS_CONN1.3 MEAS_CONN1.4 MEAS_CONN2.1 | MEAS_CONN2.7 MEAS_CONN2.5 MEAS_CONN2.3 MEAS_CONN2.1 | MEAS_CONN2.1 | MEAS_CONN2.1
N$4
  Top 1.016: FUSE.1 15.7,70.68 DC-IN.3
N$5
  Top 0.406: PWR_OK.A 18.41,81.15 23.37,81.15 24.38,80.14 24.38,64.92 R5.1
N$6
  Top 1.016: PWR_SW.3 16.95,55.88 D1.A
  Bottom 1.016: PWR_SW.6 PWR_SW.3
N$8
  Top 1.016: PWR_SW.2 8.89,58.42 6.35,60.96 6.35,68.58 7.62,69.85 12.06,69.85 14.22,72.01 14.22,75.56 14.87,76.21 FUSE.2
  Bottom 1.016: PWR_SW.5 PWR_SW.2
S_THR  (via drill 0.6)
  Top 0.406: IC3.4 67.66,72.04 v69.22,70.48 | v62.23,73.66 61.59,73.66 60.96,73.03 60.96,71.75 60.33,71.12 IC2.8
  Top 1.016: S_THR.1 S_THR.2
  Bottom 0.406: v62.23,73.66 64.14,73.66 67.31,70.48 v69.22,70.48 89.7,70.48 S_THR.1
SCL
  Top 0.406: R8.1 33.66,58.42 36.2,55.88 U$1.P$10
  Bottom 0.406: SHTC3.3 11.43,32.51 14.48,35.56 25.27,35.56 31.11,41.4 31.11,53.34 | U$1.P$10 36.2,55.88 33.66,53.34 31.11,53.34 | 31.11,53.34 LCD.3
SDA  (via drill 0.6)
  Top 0.406: R9.1 v33.66,55.88 36.2,53.34 U$1.P$11
  Bottom 0.406: U$1.P$11 36.2,53.34 35.05,52.2 33.15,52.2 32.26,51.31 32.26,40.89 25.78,34.42 16.13,34.42 13.97,32.26 SHTC3.4 | LCD.4 v33.66,55.88
SIG_GEN
  Top 0.406: IC2.2 56.52,63.5 55.24,64.77 55.24,74.3 53.34,76.2 U$1.P$2
SIG_H_THR
  Top 0.406: IC2.14 43.18,69.85 41.91,68.58 41.91,48.26 39.37,45.72 U$1.P$14
SIG_L_THR
  Top 0.406: IC2.16 44.45,67.31 43.18,66.04 43.18,46.99 39.37,43.18 U$1.P$15
SIG_S_THR
  Top 0.406: IC2.12 41.91,72.39 40.64,71.12 40.64,59.69 39.37,58.42 U$1.P$9
SIG_WORK
  Top 0.406: IC2.1 55.88,62.23 53.98,64.14 53.98,73.66 52.7,74.93 41.27,74.93 40.01,73.66 U$1.P$3 36.2,73.66 35.56,73.03 35.56,62.36 34.16,60.96 R7.1
SIGNAL  (via drill 0.6)
  Top 0.406: RM.1 59.27,7.66 58.04,8.89 54.87,8.89 RM_A.2 | IC2.18 50.8,64.77 v52.07,63.5
  Top 1.016: RM_A.2 RM_A.1 | SIGNAL.1 SIGNAL.2
  Bottom 0.406: 64.14,60.96 54.61,60.96 v52.07,63.5 | 64.14,60.96 75.56,60.96 80.01,65.41 87,65.41 88.9,63.5 88.9,38.73 94.18,33.45 SIGNAL.1 | RM_A.2 58.42,12.53 58.42,31.88 64.14,37.59 64.14,60.96
V_CAP  (via drill 0.6)
  Top 0.406: IC1.3 IC1.2 v73.03,63.5 | RM_SEL.2 27.94,5.46 28.96,6.48 44.7,6.48 47.62,3.56 80.64,3.56 v81.28,4.19 | v87.76,2.16 88.9,3.3 88.9,38.73 91.24,41.07 V_CAP.1
  Top 0.61: RM_SEL.2 RM_SEL.1 MEAS_OBJ.2 MEAS_OBJ.1
  Top 1.016: V_CAP.2 V_CAP.1
  Bottom 0.406: v73.03,63.5 76.2,63.5 79.38,66.67 87.63,66.67 90.17,64.14 90.17,45.09 94.18,41.07 V_CAP.1 | v87.76,2.16 83.06,2.16 v81.28,4.19

### Text on the board
tNames: SCL | VCC | GND | SDA | HREF | LREF | PG / 2022/2023 | Capacity Sensor | MEASURING CONNECTORS | SCL | SDA | VCC | MEASURING RESISTOR | Borowicki / Arkadiusz / 179991